# Altium schematic sheet Sheet1.SchDoc
size A4
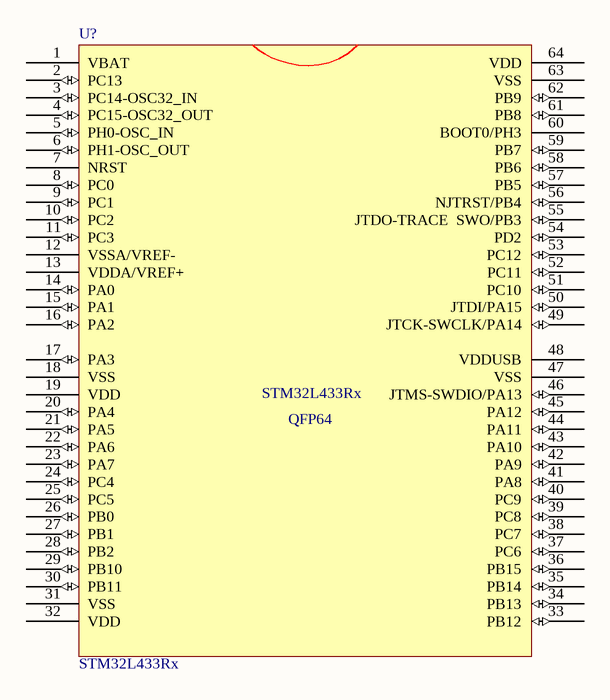
[diagram p0: Sheet1.SchDoc]

## Parts
U?  STM32L433Rx  [LQFP64]

## Nets

Not connected (* = marked no-connect by the designer): U? 1(VBAT) 2(PC13) 3(PC14-OSC32_IN) 4(PC15-OSC32_OUT) 5(PH0-OSC_IN) 6(PH1-OSC_OUT) 7(NRST) 8(PC0) 9(PC1) 10(PC2) 11(PC3) 12(VSSA/VREF-) 13(VDDA/VREF+) 14(PA0) 15(PA1) 16(PA2) 17(PA3) 18(VSS) 19(VDD) 20(PA4) 21(PA5) 22(PA6) 23(PA7) 24(PC4) 25(PC5) 26(PB0) 27(PB1) 28(PB2) 29(PB10) 30(PB11) 31(VSS) 32(VDD) 33(PB12) 34(PB13) 35(PB14) 36(PB15) 37(PC6) 38(PC7) 39(PC8) 40(PC9) 41(PA8) 42(PA9) 43(PA10) 44(PA11) 45(PA12) 46(JTMS-SWDIO/PA13) 47(VSS) 48(VDDUSB) 49(JTCK-SWCLK/PA14) 50(JTDI/PA15) 51(PC10) 52(PC11) 53(PC12) 54(PD2) 55(JTDO-TRACE__SWO/PB3) 56(NJTRST/PB4) 57(PB5) 58(PB6) 59(PB7) 60(BOOT0/PH3) 61(PB8) 62(PB9) 63(VSS) 64(VDD)

## Notes on the sheet
- (in symbol STM32L433Rx) QFP64

## Library data of the parts
U? = STM32L433Rx: 超低功耗高性能ARM Cortex-M4 32-bit MCU+FPU 80MHz 100DMIPS